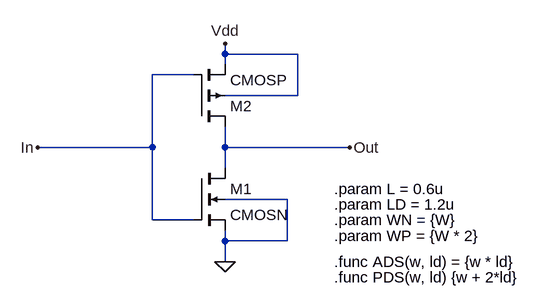
[diagram p0: schematic inversor.asc]
inversor.asc, the LTspice schematic file:
Version 4
SHEET 1 1420 680
WIRE 544 80 544 64
WIRE 656 80 544 80
WIRE 544 96 544 80
WIRE 496 112 432 112
WIRE 656 144 656 80
WIRE 656 144 544 144
WIRE 432 224 432 112
WIRE 432 224 256 224
WIRE 544 224 544 192
WIRE 736 224 544 224
WIRE 544 256 544 224
WIRE 640 304 544 304
WIRE 432 336 432 224
WIRE 496 336 432 336
WIRE 544 368 544 352
WIRE 640 368 640 304
WIRE 640 368 544 368
WIRE 544 400 544 368
FLAG 544 400 0
FLAG 544 64 Vdd
FLAG 256 224 In
FLAG 736 224 Out
SYMBOL nmos4 496 256 R0
SYMATTR InstName M1
SYMATTR Value CMOSN
SYMATTR Value2 l={L} w={WN} ad={ADS(WN, LD)} as={ADS(WN, LD)} pd={PDS(WN, LD)} ps={PDS(WN, LD)}
SYMBOL pmos4 496 192 M180
SYMATTR InstName M2
SYMATTR Value CMOSP
SYMATTR Value2 l={L} w={WP} ad={ADS(WP, LD)} as={ADS(WP, LD)} pd={PDS(WP, LD)} ps={PDS(WP, LD)}
TEXT 712 400 Left 2 !.func ADS(w, ld) = {w * ld}
TEXT 712 424 Left 2 !.func PDS(w, ld) {w + 2*ld}
TEXT 712 312 Left 2 !.param LD = 1.2u
TEXT 712 336 Left 2 !.param WN = {W}
TEXT 712 288 Left 2 !.param L = 0.6u
TEXT 712 360 Left 2 !.param WP = {W * 2}

The netlist it stands for:
* inversor.asc
M1 Out In 0 0 CMOSN l={L} w={WN} ad={ADS(WN, LD)} as={ADS(WN, LD)} pd={PDS(WN, LD)} ps={PDS(WN, LD)}
M2 Out In Vdd Vdd CMOSP l={L} w={WP} ad={ADS(WP, LD)} as={ADS(WP, LD)} pd={PDS(WP, LD)} ps={PDS(WP, LD)}
.model NMOS NMOS
.model PMOS PMOS
.lib standard.mos
.func ADS(w, ld) = {w * ld}
.func PDS(w, ld) {w + 2*ld}
.param LD = 1.2u
.param WN = {W}
.param L = 0.6u
.param WP = {W * 2}
.backanno
.end